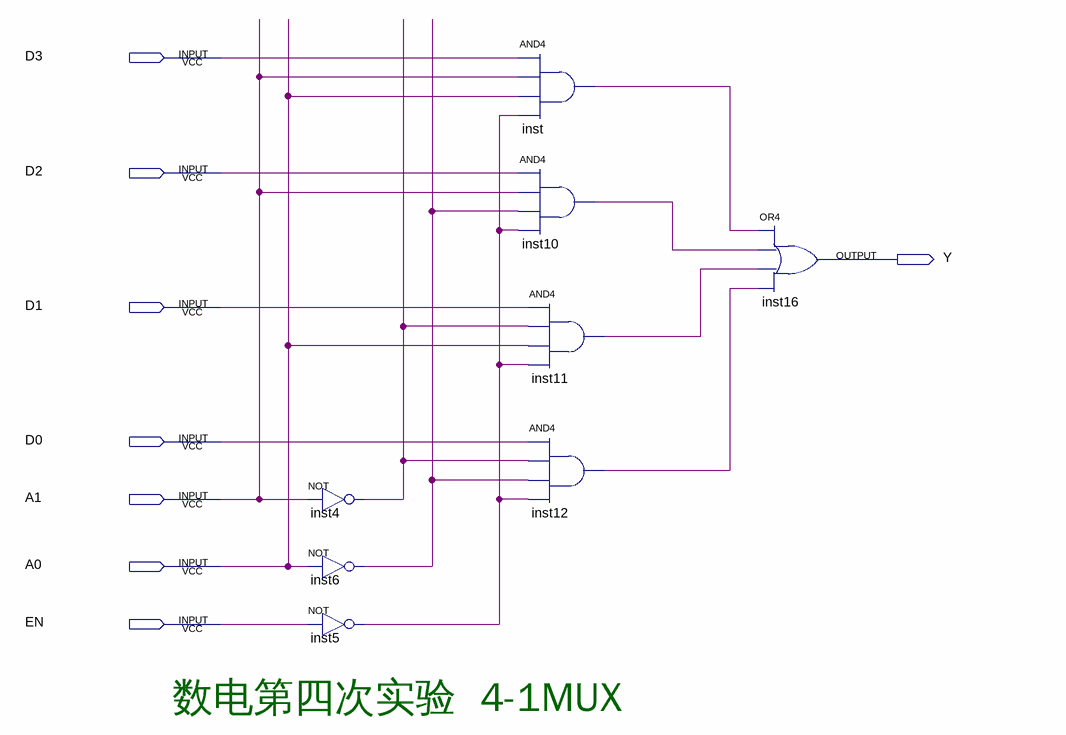
[diagram p0: schematic sheet]
// Quartus schematic sixuanyi.bdf as structural Verilog: 8 symbols, 8 pins
module sixuanyi (
  input  D3,
  input  D2,
  input  D1,
  input  D0,
  input  A1,
  input  A0,
  input  EN,
  output Y
);

  wire inst4_out, inst5_out, inst6_out, inst10_out, inst11_out, inst12_out, inst_out;

  not inst4 (inst4_out, A1);
  not inst6 (inst6_out, A0);
  not inst5 (inst5_out, EN);
  and inst (inst_out, D3, A1, A0, inst5_out);
  and inst10 (inst10_out, D2, A1, inst6_out, inst5_out);
  and inst11 (inst11_out, D1, inst4_out, A0, inst5_out);
  and inst12 (inst12_out, D0, inst4_out, inst6_out, inst5_out);
  or inst16 (Y, inst_out, inst10_out, inst11_out, inst12_out);

  // Notes on the sheet:
  //   数电第四次实验  4-1MUX
endmodule
